# Altium schematic sheet HL-SMA-KHD4HL-SMA-KHD4.schdoc
size 127 x 101 mm
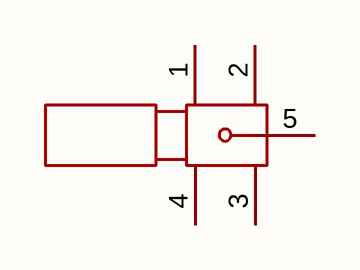
[diagram p0: HL-SMA-KHD4HL-SMA-KHD4.schdoc]

## Parts
SMA?  (no value)

## Nets

Not connected (* = marked no-connect by the designer): SMA? 1 2 3 4 5

## Library data of the parts
SMA? = HL-SMA-KHD4: Symbol: HL-SMA-KHD4